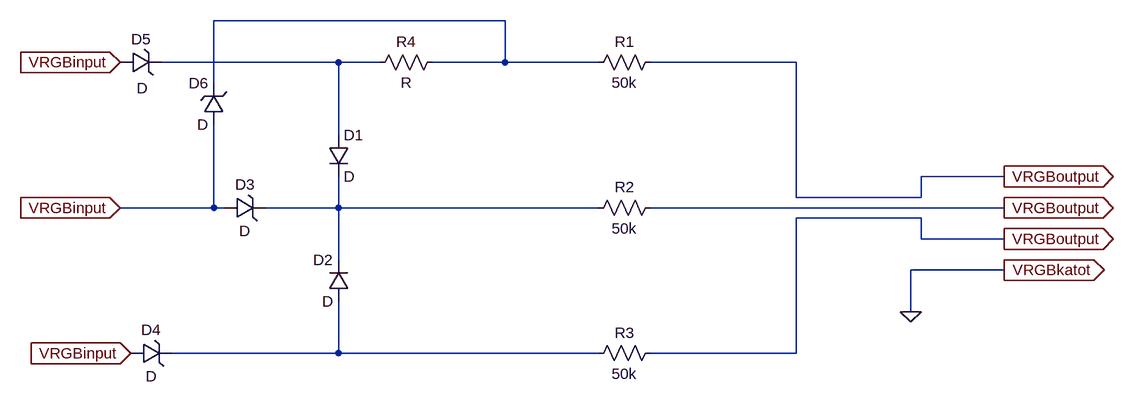
[diagram p0: schematic LED unit.asc]
LED unit.asc, the LTspice schematic file:
Version 4
SHEET 1 1052 680
WIRE 80 32 -368 32
WIRE -176 96 -448 96
WIRE -112 96 -176 96
WIRE 80 96 80 32
WIRE 80 96 -32 96
WIRE 224 96 80 96
WIRE 528 96 304 96
WIRE -368 128 -368 32
WIRE -176 208 -176 96
WIRE 848 272 720 272
WIRE 528 304 528 96
WIRE 720 304 720 272
WIRE 720 304 528 304
WIRE -368 320 -368 192
WIRE -368 320 -512 320
WIRE -352 320 -368 320
WIRE -176 320 -176 272
WIRE -176 320 -288 320
WIRE 224 320 -176 320
WIRE 848 320 304 320
WIRE 720 336 528 336
WIRE 720 368 720 336
WIRE 848 368 720 368
WIRE -176 400 -176 320
WIRE 848 416 704 416
WIRE 704 480 704 416
WIRE -176 544 -176 464
WIRE -176 544 -432 544
WIRE 224 544 -176 544
WIRE 528 544 528 336
WIRE 528 544 304 544
FLAG 704 480 0
FLAG -512 96 VRGBinput
IOPIN -512 96 In
FLAG -512 320 VRGBinput
IOPIN -512 320 In
FLAG -496 544 VRGBinput
IOPIN -496 544 In
FLAG 848 272 VRGBoutput
IOPIN 848 272 Out
FLAG 848 320 VRGBoutput
IOPIN 848 320 Out
FLAG 848 368 VRGBoutput
IOPIN 848 368 Out
FLAG 848 416 VRGBkatot
IOPIN 848 416 Out
SYMBOL res 320 80 R90
WINDOW 0 0 56 VBottom 2
WINDOW 3 32 56 VTop 2
SYMATTR InstName R1
SYMATTR Value 50k
SYMBOL res 320 304 R90
WINDOW 0 0 56 VBottom 2
WINDOW 3 32 56 VTop 2
SYMATTR InstName R2
SYMATTR Value 50k
SYMBOL res 320 528 R90
WINDOW 0 0 56 VBottom 2
WINDOW 3 32 56 VTop 2
SYMATTR InstName R3
SYMATTR Value 50k
SYMBOL res -16 80 R90
WINDOW 0 0 56 VBottom 2
WINDOW 3 32 56 VTop 2
SYMATTR InstName R4
SYMBOL diode -192 208 R0
SYMATTR InstName D1
SYMBOL diode -160 464 R180
WINDOW 0 24 64 Left 2
WINDOW 3 24 0 Left 2
SYMATTR InstName D2
SYMBOL zener -352 336 R270
WINDOW 0 36 32 VTop 2
WINDOW 3 -4 32 VBottom 2
SYMATTR InstName D3
SYMBOL zener -496 560 R270
WINDOW 0 36 32 VTop 2
WINDOW 3 -4 32 VBottom 2
SYMATTR InstName D4
SYMBOL zener -512 112 R270
WINDOW 0 36 32 VTop 2
WINDOW 3 -8 34 VBottom 2
SYMATTR InstName D5
SYMBOL zener -352 192 R180
WINDOW 0 24 64 Left 2
WINDOW 3 24 0 Left 2
SYMATTR InstName D6

The netlist it stands for:
* LED unit.asc
R1 VRGBoutput N001 50k
R2 VRGBoutput N003 50k
R3 VRGBoutput N004 50k
R4 N001 N002 R
D1 N002 N003 D
D2 N004 N003 D
D3 VRGBinput N003 D
D4 VRGBinput N004 D
D5 VRGBinput N002 D
D6 VRGBinput N001 D
.model D D
.lib standard.dio
.backanno
.end